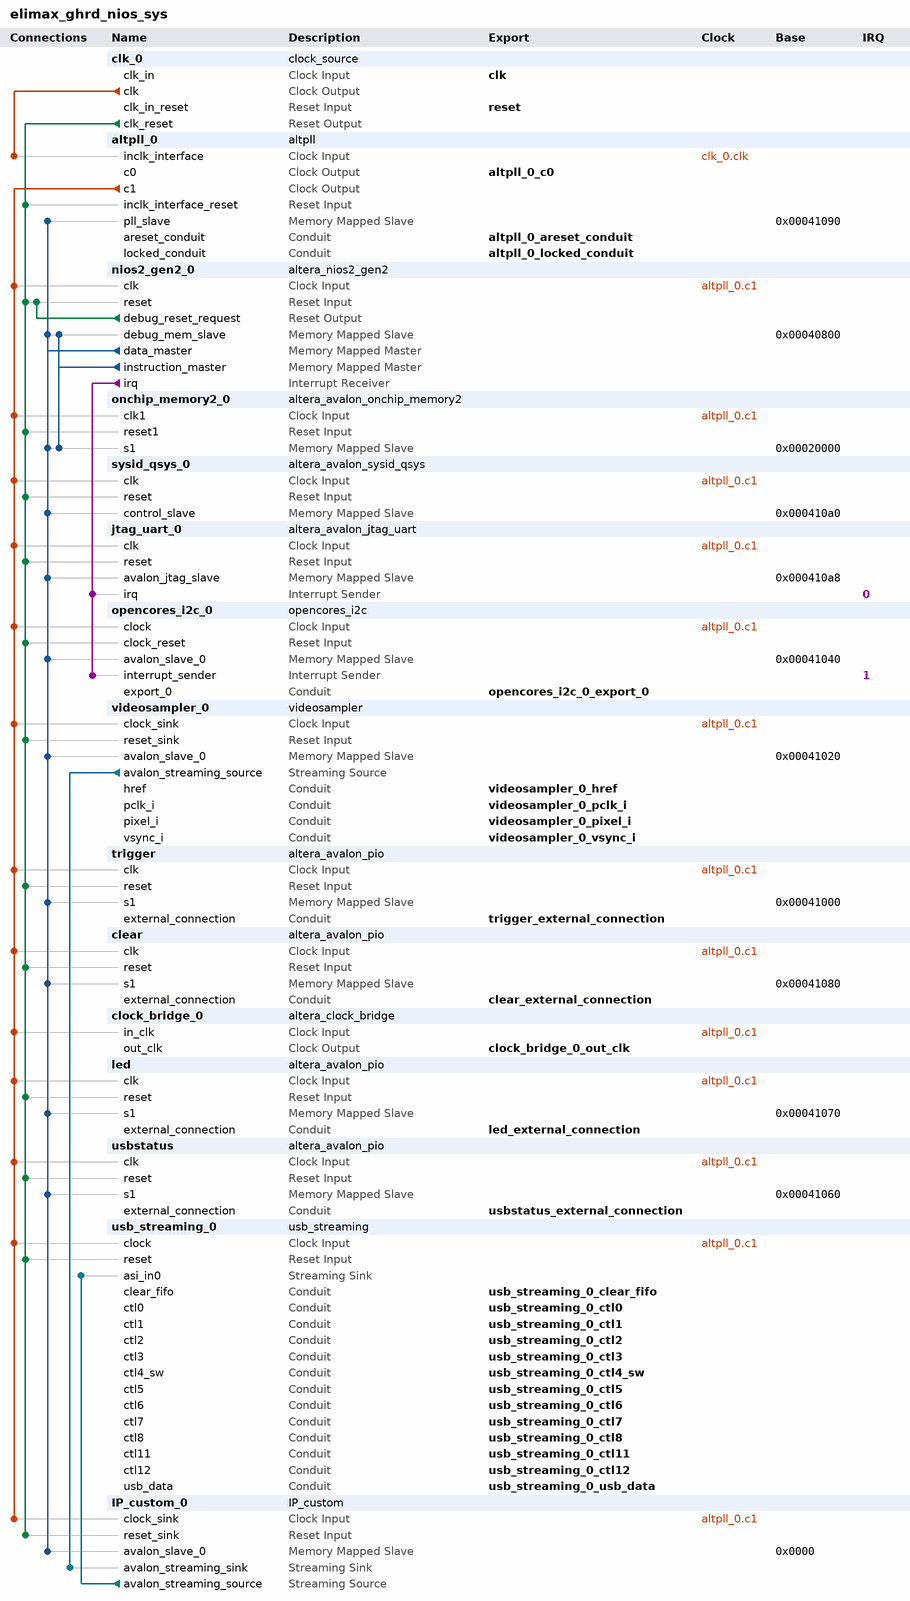
[diagram p0: system contents]
# Platform Designer (Qsys) system elimax_ghrd_nios_sys, MAX 10 10M50DAF256C8G
# Parameters at their usual value, and those the tool derives, are not listed.
package require -exact qsys 18.1
create_system elimax_ghrd_nios_sys
set_project_property DEVICE_FAMILY {MAX 10}
set_project_property DEVICE 10M50DAF256C8G

add_instance clk_0 clock_source 18.1
set_instance_parameter_value clk_0 clockFrequency 25000000

add_instance altpll_0 altpll 18.1
set_instance_parameter_value altpll_0 CLK0_DIVIDE_BY 25
set_instance_parameter_value altpll_0 CLK0_MULTIPLY_BY 9
set_instance_parameter_value altpll_0 CLK1_DIVIDE_BY 1
set_instance_parameter_value altpll_0 CLK1_DUTY_CYCLE 50
set_instance_parameter_value altpll_0 CLK1_MULTIPLY_BY 4
set_instance_parameter_value altpll_0 CLK1_PHASE_SHIFT 0
set_instance_parameter_value altpll_0 CLK2_DIVIDE_BY 1
set_instance_parameter_value altpll_0 CLK2_DUTY_CYCLE 50
set_instance_parameter_value altpll_0 CLK2_MULTIPLY_BY 4
set_instance_parameter_value altpll_0 CLK2_PHASE_SHIFT 2500
set_instance_parameter_value altpll_0 CLK3_DIVIDE_BY 1
set_instance_parameter_value altpll_0 CLK3_DUTY_CYCLE 50
set_instance_parameter_value altpll_0 CLK3_MULTIPLY_BY 4
set_instance_parameter_value altpll_0 CLK3_PHASE_SHIFT 5000
set_instance_parameter_value altpll_0 CLK4_DIVIDE_BY 1
set_instance_parameter_value altpll_0 CLK4_DUTY_CYCLE 50
set_instance_parameter_value altpll_0 CLK4_MULTIPLY_BY 4
set_instance_parameter_value altpll_0 CLK4_PHASE_SHIFT 0
set_instance_parameter_value altpll_0 INCLK0_INPUT_FREQUENCY 40000
set_instance_parameter_value altpll_0 PORT_ARESET PORT_USED
set_instance_parameter_value altpll_0 PORT_LOCKED PORT_USED
set_instance_parameter_value altpll_0 PORT_clk1 PORT_USED
set_instance_parameter_value altpll_0 PORT_clk2 PORT_UNUSED
set_instance_parameter_value altpll_0 PORT_clk3 PORT_UNUSED

add_instance nios2_gen2_0 altera_nios2_gen2 18.1
set_instance_parameter_value nios2_gen2_0 dcache_size 2048
set_instance_parameter_value nios2_gen2_0 exceptionSlave onchip_memory2_0.s1
set_instance_parameter_value nios2_gen2_0 icache_size 4096
set_instance_parameter_value nios2_gen2_0 impl Tiny
set_instance_parameter_value nios2_gen2_0 resetSlave onchip_memory2_0.s1

add_instance onchip_memory2_0 altera_avalon_onchip_memory2 18.1
set_instance_parameter_value onchip_memory2_0 dataWidth 32
set_instance_parameter_value onchip_memory2_0 dualPort false
set_instance_parameter_value onchip_memory2_0 initMemContent true
set_instance_parameter_value onchip_memory2_0 initializationFileName software/cmos/mem_init/elimax_ghrd_nios_sys_onchip_memory2_0.hex
set_instance_parameter_value onchip_memory2_0 memorySize 131072
set_instance_parameter_value onchip_memory2_0 useNonDefaultInitFile true

add_instance sysid_qsys_0 altera_avalon_sysid_qsys 18.1
set_instance_parameter_value sysid_qsys_0 id 0

add_instance jtag_uart_0 altera_avalon_jtag_uart 18.1
set_instance_parameter_value jtag_uart_0 simInteractiveOptions NO_INTERACTIVE_WINDOWS

add_instance opencores_i2c_0 opencores_i2c 9.1

add_instance videosampler_0 videosampler 4.0
set_instance_parameter_value videosampler_0 DATA_WIDTH 32
set_instance_parameter_value videosampler_0 DEFAULT_FLOWLENGTH 262144
set_instance_parameter_value videosampler_0 DEFAULT_SCR 0
set_instance_parameter_value videosampler_0 FIFO_DEPTH 2048
set_instance_parameter_value videosampler_0 HREF_POLARITY high
set_instance_parameter_value videosampler_0 PIXEL_WIDTH 8
set_instance_parameter_value videosampler_0 VSYNC_POLARITY high

add_instance trigger altera_avalon_pio 18.1
set_instance_parameter_value trigger bitModifyingOutReg true
set_instance_parameter_value trigger direction Output
set_instance_parameter_value trigger width 1

add_instance clear altera_avalon_pio 18.1
set_instance_parameter_value clear direction Output
set_instance_parameter_value clear width 1

add_instance clock_bridge_0 altera_clock_bridge 18.1
set_instance_parameter_value clock_bridge_0 DERIVED_CLOCK_RATE 100000000
set_instance_parameter_value clock_bridge_0 EXPLICIT_CLOCK_RATE 100000000

add_instance led altera_avalon_pio 18.1
set_instance_parameter_value led direction Output
set_instance_parameter_value led width 2

add_instance usbstatus altera_avalon_pio 18.1
set_instance_parameter_value usbstatus bitClearingEdgeCapReg true
set_instance_parameter_value usbstatus captureEdge true
set_instance_parameter_value usbstatus direction Input
set_instance_parameter_value usbstatus width 4

add_instance usb_streaming_0 usb_streaming 1.0

add_instance IP_custom_0 IP_custom 1.0

# connections
add_connection altpll_0.c1 clear.clk clock
add_connection altpll_0.c1 clock_bridge_0.in_clk clock
add_connection altpll_0.c1 IP_custom_0.clock_sink clock
add_connection altpll_0.c1 jtag_uart_0.clk clock
add_connection altpll_0.c1 led.clk clock
add_connection altpll_0.c1 nios2_gen2_0.clk clock
add_connection altpll_0.c1 onchip_memory2_0.clk1 clock
add_connection altpll_0.c1 opencores_i2c_0.clock clock
add_connection altpll_0.c1 sysid_qsys_0.clk clock
add_connection altpll_0.c1 trigger.clk clock
add_connection altpll_0.c1 usb_streaming_0.clock clock
add_connection altpll_0.c1 usbstatus.clk clock
add_connection altpll_0.c1 videosampler_0.clock_sink clock
add_connection clk_0.clk altpll_0.inclk_interface clock
add_connection clk_0.clk_reset altpll_0.inclk_interface_reset reset
add_connection clk_0.clk_reset clear.reset reset
add_connection clk_0.clk_reset IP_custom_0.reset_sink reset
add_connection clk_0.clk_reset jtag_uart_0.reset reset
add_connection clk_0.clk_reset led.reset reset
add_connection clk_0.clk_reset nios2_gen2_0.reset reset
add_connection clk_0.clk_reset onchip_memory2_0.reset1 reset
add_connection clk_0.clk_reset opencores_i2c_0.clock_reset reset
add_connection clk_0.clk_reset sysid_qsys_0.reset reset
add_connection clk_0.clk_reset trigger.reset reset
add_connection clk_0.clk_reset usb_streaming_0.reset reset
add_connection clk_0.clk_reset usbstatus.reset reset
add_connection clk_0.clk_reset videosampler_0.reset_sink reset
add_connection nios2_gen2_0.debug_reset_request nios2_gen2_0.reset reset
add_connection nios2_gen2_0.data_master altpll_0.pll_slave avalon
set_connection_parameter_value nios2_gen2_0.data_master/altpll_0.pll_slave baseAddress 0x00041090
add_connection nios2_gen2_0.data_master clear.s1 avalon
set_connection_parameter_value nios2_gen2_0.data_master/clear.s1 baseAddress 0x00041080
add_connection nios2_gen2_0.data_master IP_custom_0.avalon_slave_0 avalon
set_connection_parameter_value nios2_gen2_0.data_master/IP_custom_0.avalon_slave_0 baseAddress 0x0000
add_connection nios2_gen2_0.data_master jtag_uart_0.avalon_jtag_slave avalon
set_connection_parameter_value nios2_gen2_0.data_master/jtag_uart_0.avalon_jtag_slave baseAddress 0x000410a8
add_connection nios2_gen2_0.data_master led.s1 avalon
set_connection_parameter_value nios2_gen2_0.data_master/led.s1 baseAddress 0x00041070
add_connection nios2_gen2_0.data_master nios2_gen2_0.debug_mem_slave avalon
set_connection_parameter_value nios2_gen2_0.data_master/nios2_gen2_0.debug_mem_slave baseAddress 0x00040800
add_connection nios2_gen2_0.data_master onchip_memory2_0.s1 avalon
set_connection_parameter_value nios2_gen2_0.data_master/onchip_memory2_0.s1 baseAddress 0x00020000
add_connection nios2_gen2_0.data_master opencores_i2c_0.avalon_slave_0 avalon
set_connection_parameter_value nios2_gen2_0.data_master/opencores_i2c_0.avalon_slave_0 baseAddress 0x00041040
add_connection nios2_gen2_0.data_master sysid_qsys_0.control_slave avalon
set_connection_parameter_value nios2_gen2_0.data_master/sysid_qsys_0.control_slave baseAddress 0x000410a0
add_connection nios2_gen2_0.data_master trigger.s1 avalon
set_connection_parameter_value nios2_gen2_0.data_master/trigger.s1 baseAddress 0x00041000
add_connection nios2_gen2_0.data_master usbstatus.s1 avalon
set_connection_parameter_value nios2_gen2_0.data_master/usbstatus.s1 baseAddress 0x00041060
add_connection nios2_gen2_0.data_master videosampler_0.avalon_slave_0 avalon
set_connection_parameter_value nios2_gen2_0.data_master/videosampler_0.avalon_slave_0 baseAddress 0x00041020
add_connection nios2_gen2_0.instruction_master nios2_gen2_0.debug_mem_slave avalon
set_connection_parameter_value nios2_gen2_0.instruction_master/nios2_gen2_0.debug_mem_slave baseAddress 0x00040800
add_connection nios2_gen2_0.instruction_master onchip_memory2_0.s1 avalon
set_connection_parameter_value nios2_gen2_0.instruction_master/onchip_memory2_0.s1 baseAddress 0x00020000
add_connection IP_custom_0.avalon_streaming_source usb_streaming_0.asi_in0 avalon_streaming
add_connection videosampler_0.avalon_streaming_source IP_custom_0.avalon_streaming_sink avalon_streaming
add_connection nios2_gen2_0.irq jtag_uart_0.irq interrupt
set_connection_parameter_value nios2_gen2_0.irq/jtag_uart_0.irq irqNumber 0
add_connection nios2_gen2_0.irq opencores_i2c_0.interrupt_sender interrupt
set_connection_parameter_value nios2_gen2_0.irq/opencores_i2c_0.interrupt_sender irqNumber 1

# exported interfaces
add_interface altpll_0_areset_conduit conduit end
set_interface_property altpll_0_areset_conduit EXPORT_OF altpll_0.areset_conduit
add_interface altpll_0_c0 clock source
set_interface_property altpll_0_c0 EXPORT_OF altpll_0.c0
add_interface altpll_0_locked_conduit conduit end
set_interface_property altpll_0_locked_conduit EXPORT_OF altpll_0.locked_conduit
add_interface clear_external_connection conduit end
set_interface_property clear_external_connection EXPORT_OF clear.external_connection
add_interface clk clock sink
set_interface_property clk EXPORT_OF clk_0.clk_in
add_interface clock_bridge_0_out_clk clock source
set_interface_property clock_bridge_0_out_clk EXPORT_OF clock_bridge_0.out_clk
add_interface led_external_connection conduit end
set_interface_property led_external_connection EXPORT_OF led.external_connection
add_interface opencores_i2c_0_export_0 conduit end
set_interface_property opencores_i2c_0_export_0 EXPORT_OF opencores_i2c_0.export_0
add_interface reset reset sink
set_interface_property reset EXPORT_OF clk_0.clk_in_reset
add_interface trigger_external_connection conduit end
set_interface_property trigger_external_connection EXPORT_OF trigger.external_connection
add_interface usb_streaming_0_clear_fifo conduit end
set_interface_property usb_streaming_0_clear_fifo EXPORT_OF usb_streaming_0.clear_fifo
add_interface usb_streaming_0_ctl0 conduit end
set_interface_property usb_streaming_0_ctl0 EXPORT_OF usb_streaming_0.ctl0
add_interface usb_streaming_0_ctl1 conduit end
set_interface_property usb_streaming_0_ctl1 EXPORT_OF usb_streaming_0.ctl1
add_interface usb_streaming_0_ctl11 conduit end
set_interface_property usb_streaming_0_ctl11 EXPORT_OF usb_streaming_0.ctl11
add_interface usb_streaming_0_ctl12 conduit end
set_interface_property usb_streaming_0_ctl12 EXPORT_OF usb_streaming_0.ctl12
add_interface usb_streaming_0_ctl2 conduit end
set_interface_property usb_streaming_0_ctl2 EXPORT_OF usb_streaming_0.ctl2
add_interface usb_streaming_0_ctl3 conduit end
set_interface_property usb_streaming_0_ctl3 EXPORT_OF usb_streaming_0.ctl3
add_interface usb_streaming_0_ctl4_sw conduit end
set_interface_property usb_streaming_0_ctl4_sw EXPORT_OF usb_streaming_0.ctl4_sw
add_interface usb_streaming_0_ctl5 conduit end
set_interface_property usb_streaming_0_ctl5 EXPORT_OF usb_streaming_0.ctl5
add_interface usb_streaming_0_ctl6 conduit end
set_interface_property usb_streaming_0_ctl6 EXPORT_OF usb_streaming_0.ctl6
add_interface usb_streaming_0_ctl7 conduit end
set_interface_property usb_streaming_0_ctl7 EXPORT_OF usb_streaming_0.ctl7
add_interface usb_streaming_0_ctl8 conduit end
set_interface_property usb_streaming_0_ctl8 EXPORT_OF usb_streaming_0.ctl8
add_interface usb_streaming_0_usb_data conduit end
set_interface_property usb_streaming_0_usb_data EXPORT_OF usb_streaming_0.usb_data
add_interface usbstatus_external_connection conduit end
set_interface_property usbstatus_external_connection EXPORT_OF usbstatus.external_connection
add_interface videosampler_0_href conduit end
set_interface_property videosampler_0_href EXPORT_OF videosampler_0.href
add_interface videosampler_0_pclk_i conduit end
set_interface_property videosampler_0_pclk_i EXPORT_OF videosampler_0.pclk_i
add_interface videosampler_0_pixel_i conduit end
set_interface_property videosampler_0_pixel_i EXPORT_OF videosampler_0.pixel_i
add_interface videosampler_0_vsync_i conduit end
set_interface_property videosampler_0_vsync_i EXPORT_OF videosampler_0.vsync_i

set_interconnect_requirement {$system} qsys_mm.clockCrossingAdapter HANDSHAKE
set_interconnect_requirement {$system} qsys_mm.enableEccProtection FALSE
set_interconnect_requirement {$system} qsys_mm.insertDefaultSlave FALSE
set_interconnect_requirement {$system} qsys_mm.maxAdditionalLatency 1

save_system elimax_ghrd_nios_sys.qsys
